# EasyEDA Pro project ProDoc_TC264主板V2.0_2025-08-21.epro, schematic Schematic1_4
Board Name: TC264主板V2.0; Create Date: 2025-06-05; Page Name: P1; Project Name: 2025双车主板_备份; Schematic Name: Schematic1_4; Update Date: 2025-08-20; Company: 嘉立创EDA; Page Size: A4; Version: V1.0
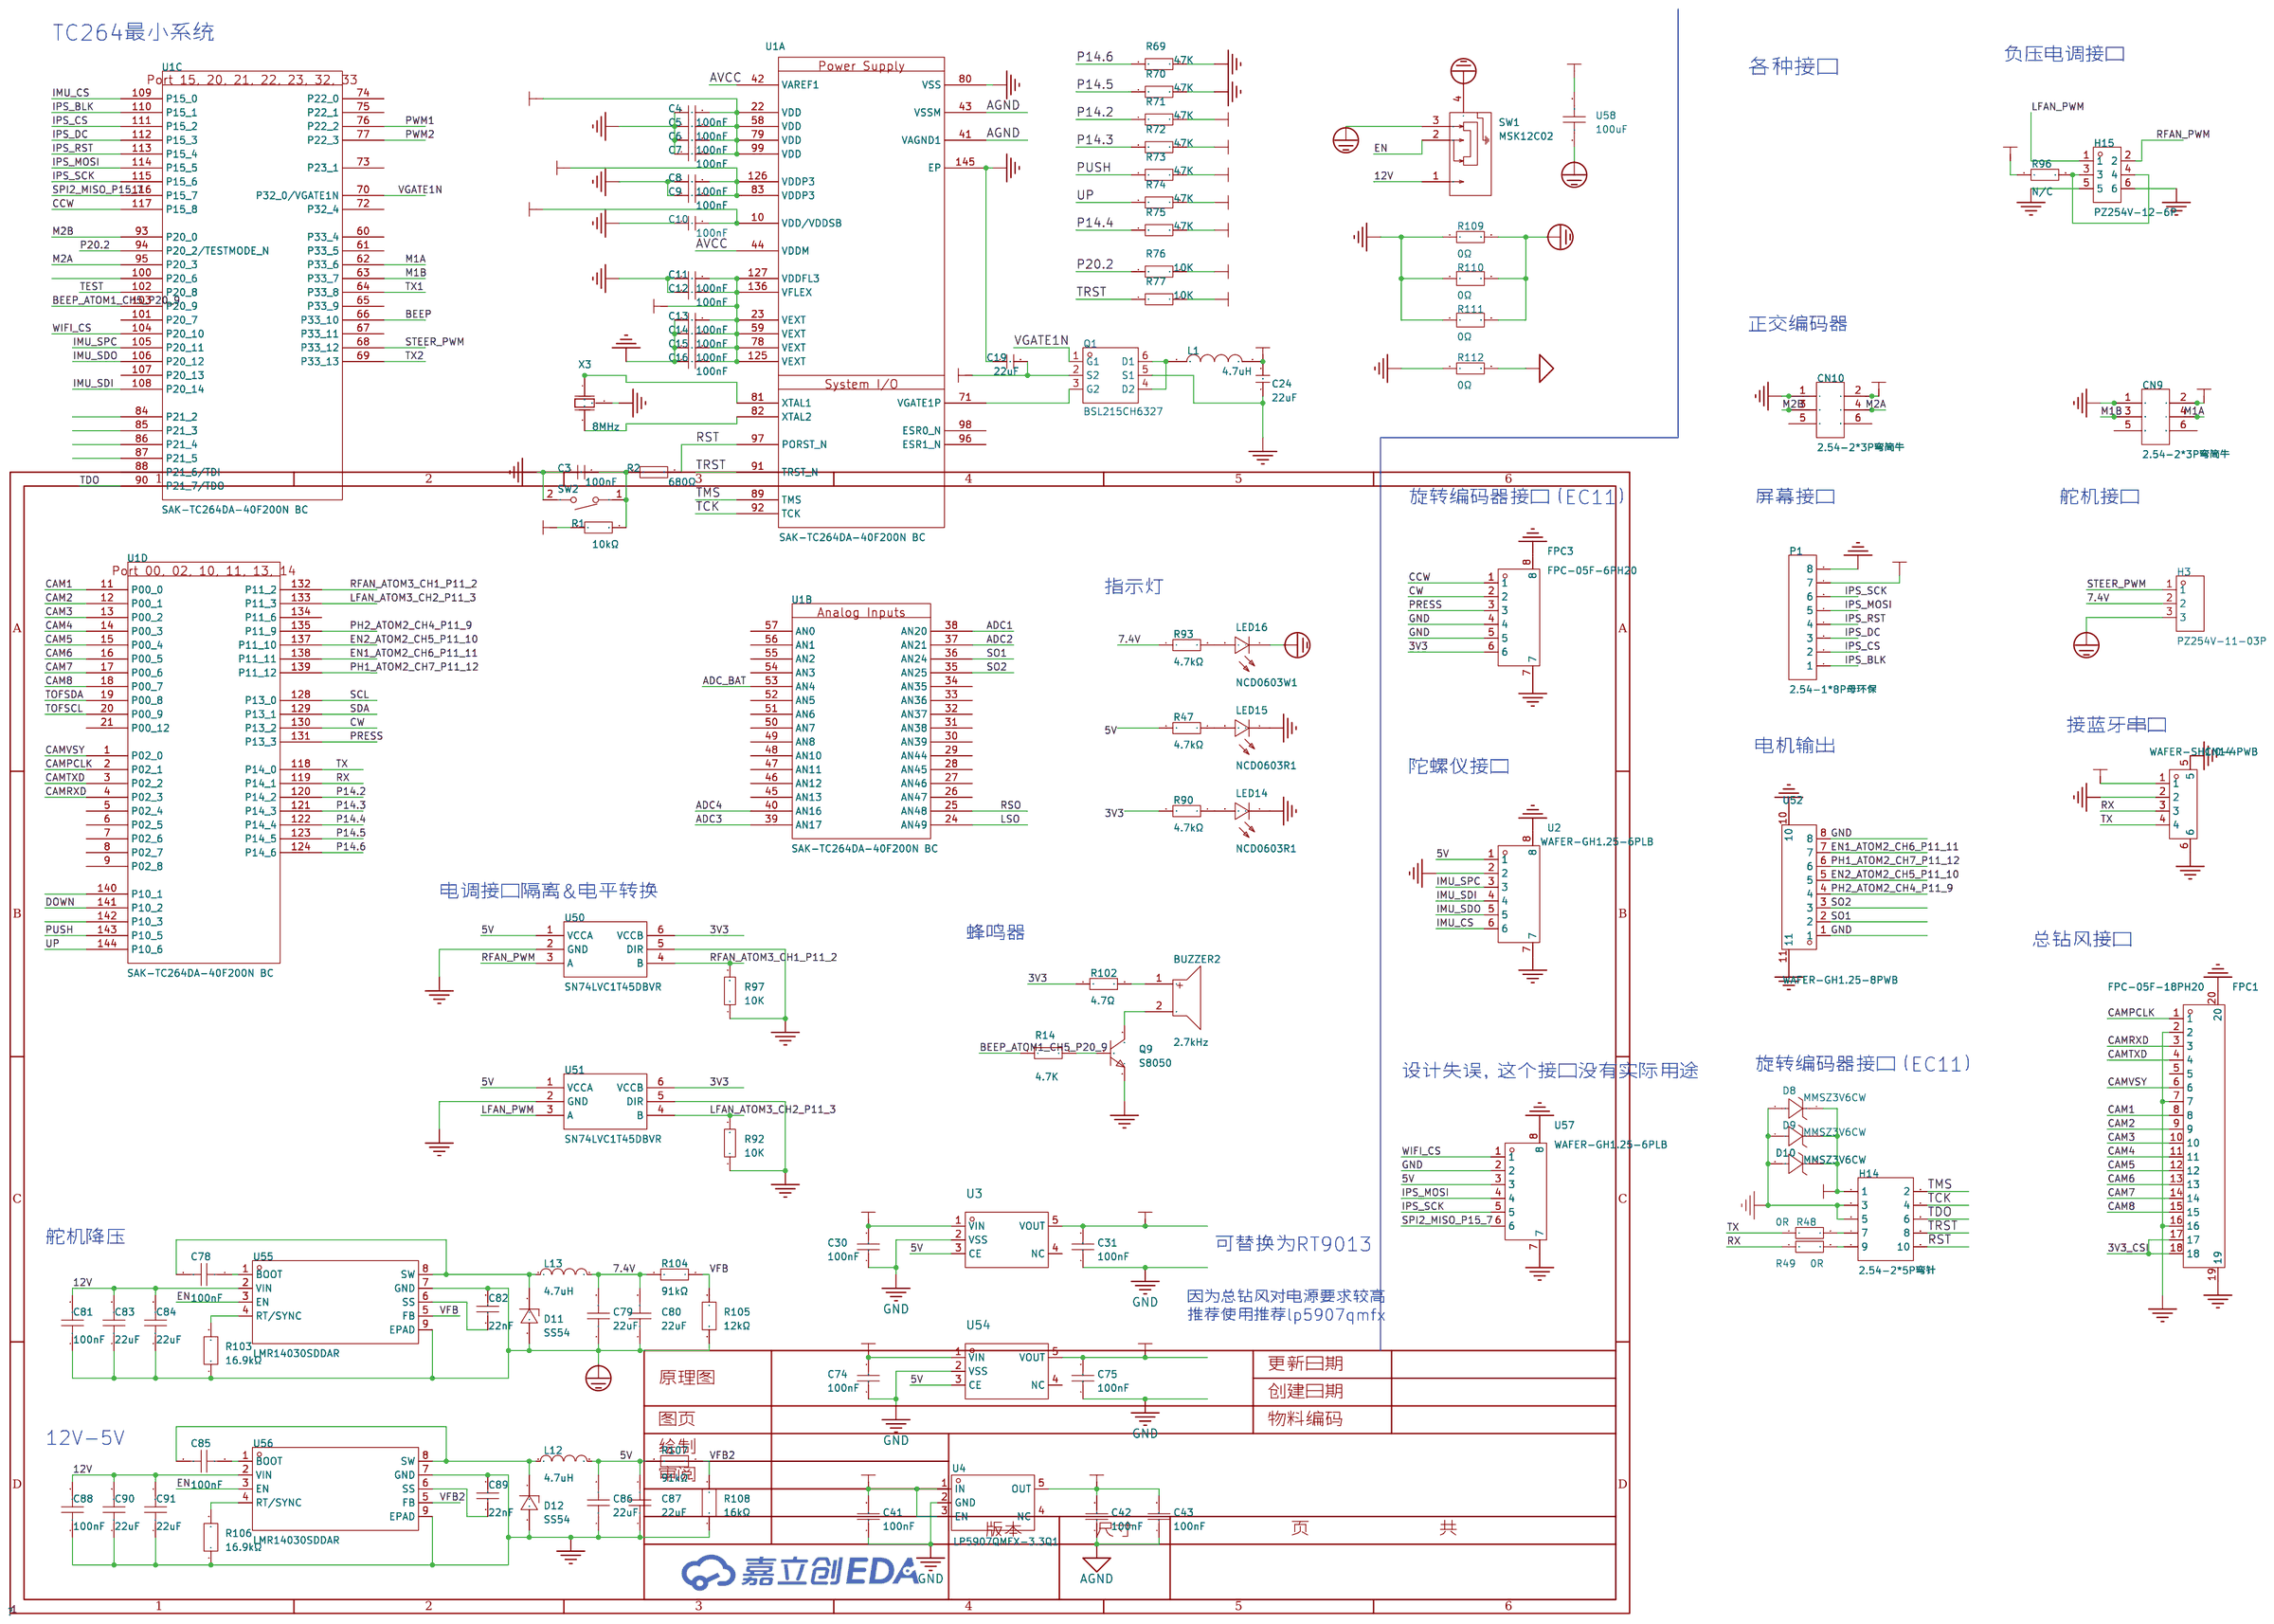
[diagram p0: schematic sheet]

## Parts
BUZZER2  2.7kHz  [BUZ-TH_BD9.0-P4.00-D0.6-FD]
C3  100nF  [C0603]
C4  100nF  [C0603]
C5  100nF  [C0603]
C6  100nF  [C0603]
C7  100nF  [C0603]
C8  100nF  [C0603]
C9  100nF  [C0603]
C10  100nF  [C0603]
C11  100nF  [C0603]
C12  100nF  [C0603]
C13  100nF  [C0603]
C14  100nF  [C0603]
C15  100nF  [C0603]
C16  100nF  [C0603]
C19  22uF  [C0805]
C24  22uF  [C0805]
C30  100nF  [C0603_S]
C31  100nF  [C0603_S]
C41  100nF  [C0603_S]
C42  100nF  [C0603_S]
C43  100nF  [C0603_S]
C74  100nF  [C0603_S]
C75  100nF  [C0603_S]
C78  100nF  [C0603]
C79  22uF  [C0805]
C80  22uF  [C0805]
C81  100nF  [C0603]
C82  22nF  [C0603]
C83  22uF  [C0805]
C84  22uF  [C0805]
C85  100nF  [C0603]
C86  22uF  [C0805]
C87  22uF  [C0805]
C88  100nF  [C0603]
C89  22nF  [C0603]
C90  22uF  [C0805]
C91  22uF  [C0805]
CN9  2.54-2*3P弯简牛  [IDC-TH_6P-P2.54-H-R2-C3-S2.54]
CN10  2.54-2*3P弯简牛  [IDC-TH_6P-P2.54-H-R2-C3-S2.54]
CN14  WAFER-SH1.0-4PWB  [CONN-SMD_4P-P1.00_WAFER-SH1.0-4PWB]
D8  MMSZ3V6CW  [SOD-123_L2.7-W1.6-LS3.7-RD-1]
D9  MMSZ3V6CW  [SOD-123_L2.7-W1.6-LS3.7-RD-1]
D10  MMSZ3V6CW  [SOD-123_L2.7-W1.6-LS3.7-RD-1]
D11  SS54  [SMA_L4.3-W2.6-LS5.0-FD]
D12  SS54  [SMA_L4.3-W2.6-LS5.0-FD]
FPC1  FPC-05F-18PH20  [FPC-SMD_18P-P0.50_FPC-05F-18PH20]
FPC3  FPC-05F-6PH20  [FPC-SMD_6P-P0.50_XUNPU_FPC-05F-6PH20]
H3  PZ254V-11-03P  [HDR-TH_3P-P2.54-V-M]
H14  2.54-2*5P弯针  [HDR-TH_10P-P2.54-H-M-R2-C5-S2.54-W12.9]
H15  PZ254V-12-6P  [HDR-TH_6P-P2.54-V-M-R2-C3-S2.54]
L1  4.7uH  [L0805]
L12  4.7uH  [IND-SMD_L7.0-W6.6]
L13  4.7uH  [IND-SMD_L7.0-W6.6]
LED14  NCD0603R1  [LED0603-RD_RED]
LED15  NCD0603R1  [LED0603-RD_RED]
LED16  NCD0603W1  [LED0603-RD]
P1  2.54-1*8P母环保  [HDR-TH_8P-P2.54-V-F-1]
Q1  BSL215CH6327  [TSOP-6_L3.0-W1.5-P0.95-LS2.8-BL]
Q9  S8050  [SOT-23-3_L2.9-W1.3-P1.90-LS2.4-BR]
R1  10kΩ  [R0603]
R2  680Ω  [R0603]
R14  4.7K  [R0603]
R47  4.7kΩ  [R0603]
R48  0R  [R0603]
R49  0R  [R0603]
R69  47K  [R0603]
R70  47K  [R0603]
R71  47K  [R0603]
R72  47K  [R0603]
R73  47K  [R0603]
R74  47K  [R0603]
R75  47K  [R0603]
R76  10K  [R0603]
R77  10K  [R0603]
R90  4.7kΩ  [R0603]
R92  10K  [R0603]
R93  4.7kΩ  [R0603]
R96  N/C  [R0603]
R97  10K  [R0603]
R102  4.7Ω  [R0603]
R103  16.9kΩ  [R0603]
R104  91kΩ  [R0603]
R105  12kΩ  [R0603]
R106  16.9kΩ  [R0603]
R107  91kΩ  [R0603]
R108  16kΩ  [R0603]
R109  0Ω  [R1206]
R110  0Ω  [R1206]
R111  0Ω  [R1206]
R112  0Ω  [R0603]
SW1  MSK12C02  [SW-TH_MSK12C02]
SW2  TS-1063S-B3D4  [KEY-SMD_L3.0-W2.5-LS4.0_TS-1603S]
U1  SAK-TC264DA-40F200N BC  [LQFP-144_L20.0-W20.0-P0.50-LS22.0-BL-EP-1]  (sections 1,2,3,4)
U2  WAFER-GH1.25-6PLB  [CONN-SMD_6P-P1.25_XUNPU_WAFER-GH1.25-6PLB]
U3  XC6210B332MR  [SOT-23-5_L3.0-W1.7-P0.95-LS2.8-BR]
U4  LP5907QMFX-3.3Q1  [SOT-23-5_L3.0-W1.7-P0.95-LS2.8-BR]
U50  SN74LVC1T45DBVR  [SOT-23-6_L2.9-W1.6-P0.95-LS2.8-BR]
U51  SN74LVC1T45DBVR  [SOT-23-6_L2.9-W1.6-P0.95-LS2.8-BR]
U52  WAFER-GH1.25-8PWB  [CONN-SMD_8P-P1.25_XUNPU-WAFER-GH1.25-8PWB]
U54  XC6210B332MR  [SOT-23-5_L3.0-W1.7-P0.95-LS2.8-BR]
U55  LMR14030SDDAR  [SO-8_L4.9-W3.9-P1.27-LS6.0-BL-EP]
U56  LMR14030SDDAR  [SO-8_L4.9-W3.9-P1.27-LS6.0-BL-EP]
U57  WAFER-GH1.25-6PLB  [CONN-SMD_6P-P1.25_XUNPU_WAFER-GH1.25-6PLB]
U58  100uF  [C1210]
X3  8MHz  [OSC-SMD_3P-L3.2-W1.3-P1.20-L]

## Library data of the parts
BUZZER2 = QMB-09B-03: 驱动方式:无源(外部驱动);构造类型:电磁式;频率:2.7kHz;声压(SPL):85dB@3V,10cm;; LCSC Part Name: 无源蜂鸣器QMB-09B-03; Supplier Part: C96256; Manufacturer: 华能; Supplier Footprint: 插件,D=9mm; JLCPCB Part Class: 扩展库; Datasheet: https://atta.szlcsc.com/upload/public/pdf/source/20210401/C96256_958B17753B5AD7CBFBCFFC7C095B4484.pdf; Supplier: LCSC; Oscillator Circuit: 无源(外部驱动); Technology Type: 电磁式; Operating Voltage: 2V~5V; Sound Pressure Level (SPL): 85dB@3V,10cm; Diameter (φD): 9mm; Height: 5.7mm
C3-C16 = 0603B104K500NT: 容值:100nF;精度:±10%;额定电压:50V;材质(温度系数):X7R;; LCSC Part Name: 100nF ±10% 50V; Supplier Part: C30926; Manufacturer: FH(风华); Supplier Footprint: 0603; JLCPCB Part Class: Extended Part; Datasheet: https://atta.szlcsc.com/upload/public/pdf/source/20170923/C30926_1506149436298988724.pdf; Supplier: LCSC; Tolerance: ±10%; Voltage Rated: 50V; Temperature Coefficient: X7R; Origin Footprint 1: C 0603_L; Design Item ID: C; Library Name: 0.1 - 电阻-电容-电感; BOM名称: 无极性贴片电容; 优秀评价可免费更新: 联系淘宝ID：黄晶宝石，获取更新版封装库; 卖家免费技术支持，联系售后: 唯一出售店铺网址https://shop463601444.taobao.com; 本封装库来自淘宝卖家 ID：黄晶宝石: 其他店铺购入均为盗版，请立即申请退款; Origin Footprint 2: C 0201_L; Origin Footprint 3: C 0402_L; Origin Footprint 4: C 0805_L; Origin Footprint 5: C 1206_L; Origin Footprint 6: C 1210_L; Origin Footprint 7: C 1808_L; Origin Footprint 8: C 1812_L; Origin Footprint 9: C 1825_L; Origin Footprint 10: C 2225_L; Origin Footprint 11: C 0201_M; Origin Footprint 12: C 0402_M; Origin Footprint 13: C 0603_M; Origin Footprint 14: C 0805_M; Origin Footprint 15: C 1206_M; Origin Footprint 16: C 1210_M; Origin Footprint 17: C 1808_M; Origin Footprint 18: C 1812_M; Origin Footprint 19: C 1825_M; Origin Footprint 20: C 2225_M
C19 C24 = CL21A226MAQNNNE_C45783: 容值:22uF;精度:±20%;额定电压:25V;材质(温度系数):X5R;; LCSC Part Name: 22uF ±20% 25V; Supplier Part: C45783; Manufacturer: SAMSUNG(三星); Manufacturer Part: CL21A226MAQNNNE; Supplier Footprint: 0805; JLCPCB Part Class: Basic Part; Datasheet: https://atta.szlcsc.com/upload/public/pdf/source/20160218/1457707763339.pdf; Supplier: LCSC; Tolerance: ±20%; Voltage Rated: 25V; Temperature Coefficient: X5R; Origin Footprint 1: C 0805_L; Design Item ID: C; Library Name: 0.1 - 电阻-电容-电感; BOM名称: 无极性贴片电容; 优秀评价可免费更新: 联系淘宝ID：黄晶宝石，获取更新版封装库; 卖家免费技术支持，联系售后: 唯一出售店铺网址https://shop463601444.taobao.com; 本封装库来自淘宝卖家 ID：黄晶宝石: 其他店铺购入均为盗版，请立即申请退款; Origin Footprint 2: C 0201_L; Origin Footprint 3: C 0402_L; Origin Footprint 4: C 0603_L; Origin Footprint 5: C 1206_L; Origin Footprint 6: C 1210_L; Origin Footprint 7: C 1808_L; Origin Footprint 8: C 1812_L; Origin Footprint 9: C 1825_L; Origin Footprint 10: C 2225_L; Origin Footprint 11: C 0201_M; Origin Footprint 12: C 0402_M; Origin Footprint 13: C 0603_M; Origin Footprint 14: C 0805_M; Origin Footprint 15: C 1206_M; Origin Footprint 16: C 1210_M; Origin Footprint 17: C 1808_M; Origin Footprint 18: C 1812_M; Origin Footprint 19: C 1825_M; Origin Footprint 20: C 2225_M
C30 C31 C41-C43 C74 C75 = 0603B104K500NT: 容值:100nF;精度:±10%;额定电压:50V;材质(温度系数):X7R;; LCSC Part Name: 100nF ±10% 50V; Supplier Part: C30926; Manufacturer: FH(风华); Supplier Footprint: 0603; JLCPCB Part Class: Extended Part; Datasheet: https://atta.szlcsc.com/upload/public/pdf/source/20170923/C30926_1506149436298988724.pdf; Supplier: LCSC; Tolerance: ±10%; Voltage Rated: 50V; Temperature Coefficient: X7R; Pin Type: IN; Check: true
C78 C81 C85 C88 = CGA0603X7R104K500JT: 容值:100nF;精度:±10%;额定电压:50V;材质(温度系数):X7R;; LCSC Part Name: 100nF ±10% 50V; Supplier Part: C6119867; Manufacturer: HRE(芯声); Supplier Footprint: 0603; JLCPCB Part Class: 扩展库; Supplier: LCSC; Tolerance: ±10%; Voltage Rated: 50V; Temperature Coefficient: X7R
C79 C80 C83 C84 C86 C87 C90 C91 = CGA0805X5R226M350MT: 容值:22uF;精度:±20%;额定电压:35V;材质(温度系数):X5R;; LCSC Part Name: 22uF ±20% 35V; Supplier Part: C6119901; Manufacturer: HRE(芯声); Supplier Footprint: 0805; JLCPCB Part Class: 扩展库; Datasheet: https://atta.szlcsc.com/upload/public/pdf/source/20231129/D589D0CC4D260F7AC3A77E53B455CCB3.pdf; Supplier: LCSC; Tolerance: ±20%; Voltage Rated: 35V; Temperature Coefficient: X5R
C82 C89 = CL10B223KB8NNNC: 容值:22nF;精度:±10%;额定电压:50V;材质(温度系数):X7R;; LCSC Part Name: 22nF ±10% 50V; Supplier Part: C21122; Manufacturer: SAMSUNG(三星); Supplier Footprint: 0603; JLCPCB Part Class: 基础库; Datasheet: https://atta.szlcsc.com/upload/public/pdf/source/20160218/1457707763339.pdf; Supplier: LCSC; Tolerance: ±10%; Voltage Rated: 50V; Temperature Coefficient: X7R
CN9 CN10 = 2.54-2*3P弯简牛: 连接器类型:简牛座;间距:2.54mm;结构:2x3P;封装形式:弯插;行距:2.54mm;排数:2;每排PIN数:3;触头材质:-;触头镀层:-;; LCSC Part Name: 2.54mm 2x3P 排数:2 每排P数:3; Supplier Part: C34945; Manufacturer: BOOMELE(博穆精密); Supplier Footprint: 弯插,P=2.54mm; JLCPCB Part Class: 扩展库; Datasheet: https://atta.szlcsc.com/upload/public/pdf/source/20151118/1457707580629.pdf; Supplier: LCSC; Connector Type: 简牛座; Pitch: 2.54mm; Structure: 2x3P; Holder Type: 弯插; Row Spacing: 2.54mm; Number of Rows: 2; Pin Number in each Row: 3
CN14 = WAFER-SH1.0-4PWB: 插针结构:1x4P;间距:1mm;安装方式:卧贴;参考系列:SH;总PIN数:4P;排数:1;每排PIN数:4;行距:-;额定电流:1A;触头材质:黄铜;触头镀层:-;工作温度:-25℃~+85℃;; LCSC Part Name: 1x4P 间距:1mm 卧贴 系列:SH; Supplier Part: C3029343; Manufacturer: XUNPU(讯普); Supplier Footprint: SMD,P=1mm,卧贴; JLCPCB Part Class: 扩展库; Datasheet: https://atta.szlcsc.com/upload/public/pdf/source/20220527/1879B8210BD3B2006BCEAC1A40D397B6.pdf; Supplier: LCSC; Pins Structure: 1x4P; Pitch: 1mm; Mounting Type: 卧贴; Reference Series: SH; Number of Pins: 4P; Number of Rows: 1; Number of PINs Per Row: 4; Current Rating: 1A; Contact Material: 黄铜; Operating Temperature: -25℃~+85℃; Voltage Rating: 50V; Plastic Material: LCP; Supplementary Features: 辅助焊脚; Color: 米色; Z-Height of the Board: 3.15mm; X-Length of Bottom Edge on Board (Spacing Line): 6.35mm; Y-Width of Bottom Edge on Board: 5.05mm
D8-D10 = MMSZ3V6CW_C2922768: 二极管配置:独立式;稳压值(标称值):3.6V;稳压值(范围):3.4V~3.8V;功率(Pd):500mW;; Supplier Part: C2922768; Manufacturer: YONGYUTAI(永裕泰); Supplier Footprint: SOD-123; JLCPCB Part Class: 扩展库; Datasheet: https://atta.szlcsc.com/upload/public/pdf/source/20211122/29A56FCE15FF4805B7432A7DEF4BEF09.pdf; Supplier: LCSC; Diode Configuration: 独立式; Zener Voltage (Nom): 3.6V; Zener Voltage (Range): 3.4V~3.8V; Power Dissipation: 500mW; Zener Impedance (Zzt): 90Ω
D11 D12 = SS54_C7420369: 二极管配置:独立式;正向压降(Vf):550mV@5.0A;直流反向耐压(Vr):40V;整流电流:5A;; LCSC Part Name: 电压:40V 电流:5A; Supplier Part: C7420369; Manufacturer: 宏迦橙; Supplier Footprint: SMA(DO-214AC); JLCPCB Part Class: 扩展库; Datasheet: https://atta.szlcsc.com/upload/public/pdf/source/20230828/254C3882F8647358AD9F60DD73611B5E.pdf; Supplier: LCSC; Diode Configuration: 独立式; Forward Voltage (Vf@If): 550mV@5.0A; Reverse Voltage (Vr): 40V; Rectified Current: 5A; Reverse Leakage Current (Ir): 50uA@40V
FPC1 = FPC-05F-18PH20: 锁定特性:翻盖式;触点类型:下接;触点数量:18P;间距:0.5mm;安装类型:卧贴;工作温度范围:-25℃~+85℃;; LCSC Part Name: 间距:0.5mm P数:18P 翻盖式 下接; Supplier Part: C2856802; Manufacturer: XUNPU(讯普); Supplier Footprint: SMD,P=0.5mm,卧贴; JLCPCB Part Class: 扩展库; Datasheet: https://atta.szlcsc.com/upload/public/pdf/source/20210922/C2856802_2A845D1961F33AEC1ED22CECB292335F.pdf; Supplier: LCSC; Locking Feature: 翻盖式; Contact Type: 下接; Number of Contacts: 18P; Pitch: 0.5mm; Mounting Type: 卧贴; FFC, FCB Thickness: 0.3mm; Height Above Board: 2mm; Operating Temperature Range: -25℃~+85℃
FPC3 = FPC-05F-6PH20: 锁定特性:翻盖式;触点类型:下接;触点数量:6P;间距:0.5mm;安装类型:卧贴;工作温度范围:-25℃~+85℃;; LCSC Part Name: 间距:0.5mm P数:6P 翻盖式 下接; Supplier Part: C2856796; Manufacturer: XUNPU(讯普); Supplier Footprint: SMD,P=0.5mm,卧贴; JLCPCB Part Class: 扩展库; Datasheet: https://atta.szlcsc.com/upload/public/pdf/source/20210922/16B003FB53336DDF6538142CC465AC4D.pdf; Supplier: LCSC; Locking Feature: 翻盖式; Contact Type: 下接; Number of Contacts: 6P; Pitch: 0.5mm; Mounting Type: 卧贴; FFC, FCB Thickness: 0.3mm; Height Above Board: 2mm; Operating Temperature Range: -25℃~+85℃
H3 = PZ254V-11-03P: 插针结构:1x3P;间距:2.54mm;行距:-;圆针/方针:方针;安装类型:直插;排数:单排;总PIN位数:3P;额定电流:3A;额定电压:250V;配合针长度:6mm;塑高:2.5mm;端接针长度:3mm;工作温度范围:-40℃~+105℃;颜色:黑色;; LCSC Part Name: 间距:2.54mm 1x3P 直插 方针; Supplier Part: C2937625; Manufacturer: XFCN(兴飞); Supplier Footprint: 插件,P=2.54mm; JLCPCB Part Class: 扩展库; Datasheet: https://atta.szlcsc.com/upload/public/pdf/source/20200309/C492402_8335C3D49C4E4C618838D59BB1D024C1.pdf; Supplier: LCSC; Pin Structure: 1x3P; Pitch: 2.54mm; Circluar Pins/Square Pins: 方针; Mounting Type: 直插; Number of Rows: 单排; Number of Pins: 3P; Current Rating (Max): 3A; Voltage Rating (Max): 250V; Length of Mating Pin: 6mm; Insulation Height: 2.5mm; Length of End Connection Pin: 3mm; Operating Temperature Range: -40℃~+105℃; Color: 黑色
H14 = 2.54-2*5P弯针: 插针结构:2x5P;间距:2.54mm;行距:2.54mm;圆针/方针:方针;安装类型:弯插;排数:双排;总PIN位数:10P;额定电流:3A;额定电压:-;配合针长度:6mm;塑高:2.54mm;触头材质:黄铜;触头镀层:-;工作温度范围:-55℃~+105℃;颜色:黑色;; LCSC Part Name: 间距:2.54mm 2x5P 弯插 方针; Supplier Part: C60563; Manufacturer: BOOMELE(博穆精密); Supplier Footprint: 弯插,P=2.54mm; JLCPCB Part Class: 扩展库; Datasheet: https://atta.szlcsc.com/upload/public/pdf/source/20201009/C60563_5FFC87C912161176506B1BF1C101B88D.pdf; Supplier: LCSC; Pin Structure: 2x5P; Pitch: 2.54mm; Row Spacing: 2.54mm; Circluar Pins/Square Pins: 方针; Mounting Type: 弯插; Number of Rows: 双排; Number of Pins: 10P; Current Rating (Max): 3A; Length of Mating Pin: 6mm; Insulation Height: 2.54mm; Contact Material: 黄铜; Operating Temperature Range: -55℃~+105℃; Color: 黑色
H15 = PZ254V-12-6P: 插针结构:2x3P;间距:2.54mm;行距:2.54mm;圆针/方针:方针;安装类型:直插;排数:双排;总PIN位数:6P;额定电流:-;额定电压:-;配合针长度:6mm;塑高:2.5mm;端接针长度:3mm;触头材质:黄铜;触头镀层:-;工作温度范围:-40℃~+105℃;颜色:黑色;; LCSC Part Name: 间距:2.54mm 2x3P 直插 方针; Supplier Part: C492420; Manufacturer: XFCN(兴飞); Supplier Footprint: 插件,P=2.54mm; JLCPCB Part Class: 扩展库; Datasheet: https://atta.szlcsc.com/upload/public/pdf/source/20200309/C492420_BAECB307B001054C09D200388220EAE6.pdf; Supplier: LCSC; Pin Structure: 2x3P; Pitch: 2.54mm; Row Spacing: 2.54mm; Circluar Pins/Square Pins: 方针; Mounting Type: 直插; Number of Rows: 双排; Number of Pins: 6P; Length of Mating Pin: 6mm; Insulation Height: 2.5mm; Length of End Connection Pin: 3mm; Contact Material: 黄铜; Operating Temperature Range: -40℃~+105℃; Color: 黑色
L1 = LQM21PL4R7MGCD: 电感值:4.7uH;精度:±20%;额定电流:500mA;饱和电流(Isat):-;直流电阻(DCR):812mΩ;; LCSC Part Name: 4.7uH ±20% 812mΩ; Supplier Part: C86088; Manufacturer: muRata(村田); Supplier Footprint: 0805; JLCPCB Part Class: Extended Part; Datasheet: https://atta.szlcsc.com/upload/public/pdf/source/20170914/C86088_1505374139550969215.pdf; Supplier: LCSC; Tolerance: ±20%; Rated Current: 500mA; DC Resistance (DCR): 812mΩ; Origin Footprint 1: L 0805; Design Item ID: L; Library Name: 0.1 - 电阻-电容-电感; BOM名称: 小功率贴片电感; 优秀评价可免费更新: 联系淘宝ID：黄晶宝石，获取更新版封装库; 卖家免费技术支持，联系售后: 唯一出售店铺网址https://shop463601444.taobao.com; 本封装库来自淘宝卖家 ID：黄晶宝石: 其他店铺购入均为盗版，请立即申请退款; Origin Footprint 2: L 0402; Origin Footprint 3: L 0603; Origin Footprint 4: L 1206; Origin Footprint 5: L 1210; Origin Footprint 6: L 1806; Origin Footprint 7: L 1812
L12 L13 = FXL0630-4R7-M: 电感值:4.7uH;精度:±20%;额定电流:6A;饱和电流(Isat):9A;类型:一体成型电感;; LCSC Part Name: 4.7uH ±20% 9A; Supplier Part: C167220; Manufacturer: cjiang(长江微电); Supplier Footprint: SMD,6.6x7mm; JLCPCB Part Class: 扩展库; Datasheet: https://atta.szlcsc.com/upload/public/pdf/source/20240426/3189EA8206330E2108542F9E34E540E7.pdf; Supplier: LCSC; Tolerance: ±20%; Rated Current: 6A; Saturation Current (Isat): 9A; DC Resistance (DCR): 33mΩ; Type: 一体成型电感
LED14 LED15 = NCD0603R1_C84263: 灯头类型:-;发光颜色:红色;正向电压(VF):1.6V~2.6V;功率:65mW;正向电流:20mA;主波长:615nm~630nm;二极管配置:独立二极管;透镜颜色:无色透明透镜;色温:-;发光强度:80mcd~220mcd;发光角度:130°;载带方式:-;工作温度:-30℃~+85℃;; Supplier Part: C84263; Manufacturer: 国星光电; Supplier Footprint: 0603; JLCPCB Part Class: 扩展库; Datasheet: https://atta.szlcsc.com/upload/public/pdf/source/20200820/C84263_DABC6A75E58F576973B407FDBA283D60.pdf; Supplier: LCSC; Emitted Color: 红色; Forward Voltage (VF): 1.6V~2.6V; Power Dissipation: 65mW; Forward Current: 20mA; Dominant Wavelength: 615nm~630nm; Diode Configuration: 独立二极管; Lens Color: 无色透明透镜; Luminous Intensity: 80mcd~220mcd; Viewing Angle: 130°; Operating Temperature: -30℃~+85℃
LED16 = NCD0603W1: 发光颜色:白色;正向电压(VF):2.6V~3.6V;功率:72mW;正向电流:5mA;透镜颜色:雾状黄透镜;发光强度:200mcd~300mcd;发光角度:130°;工作温度:-30℃~+85℃;; Supplier Part: C84265; Manufacturer: 国星光电; Supplier Footprint: 0603; JLCPCB Part Class: 扩展库; Datasheet: https://atta.szlcsc.com/upload/public/pdf/source/20200820/C84265_479E6193713348A548E5CD6D9278BF16.pdf; Supplier: LCSC; Emitted Color: 白色; Forward Voltage (VF): 2.6V~3.6V; Power Dissipation: 72mW; Forward Current: 5mA; Lens Color: 雾状黄透镜; Luminous Intensity: 200mcd~300mcd; Viewing Angle: 130°; Operating Temperature: -30℃~+85℃
P1 = 2.54-1*8P母环保: 插孔结构:1x8P;间距:2.54mm;行距:-;安装类型:直插;排数:单排;总孔位数:8P;塑高:-;触头材质:-;触头镀层:-;; LCSC Part Name: 间距:2.54mm 1x8P 直插; Supplier Part: C27438; Manufacturer: BOOMELE(博穆精密); Supplier Footprint: 插件,P=2.54mm; JLCPCB Part Class: 扩展库; Datasheet: https://atta.szlcsc.com/upload/public/pdf/source/20231221/1CA800C6799ED97958773716FAA1BFFE.pdf; Supplier: LCSC; Holes Structure: 1x8P; Pitch: 2.54mm; Mounting Type: 直插; Number of Rows: 单排; Number of Holes: 8P
Q1 = BSL215CH6327: 类型:1个N沟道和1个P沟道;漏源电压(Vdss):20V;连续漏极电流(Id):1.5A;功率(Pd):500mW;导通电阻(RDS(on)@Vgs,Id):140mΩ@4.5V,1.5A;阈值电压(Vgs(th)@Id):1.2V@3.7uA;; LCSC Part Name: 1个N沟道和1个P沟道 20V 1.5A; Supplier Part: C150914; Manufacturer: Infineon(英飞凌); Supplier Footprint: TSOP-6-1.5mm; JLCPCB Part Class: Extended Part; Datasheet: https://atta.szlcsc.com/upload/public/pdf/source/20180125/C150914_15168616334001301814.pdf; Supplier: LCSC; Type: 1个N沟道和1个P沟道; Drain Source Voltage (Vdss): 20V; Continuous Drain Current (Id): 1.5A; Power Dissipation (Pd): 500mW; Drain Source On Resistance (RDS(on)@Vgs,Id): 140mΩ@4.5V,1.5A; Gate Threshold Voltage (Vgs(th)@Id): 1.2V@3.7uA; Design Item ID: BSL215CH6327XTSA1; Library Name: TC264飞卡板
Q9 = S8050_C2891804: 晶体管类型:NPN;集电极电流(Ic):500mA;集射极击穿电压(Vceo):25V;功率(Pd):300mW;; LCSC Part Name: NPN 电流:500mA 耐压:25V; Supplier Part: C2891804; Manufacturer: YONGYUTAI(永裕泰); Supplier Footprint: SOT-23; JLCPCB Part Class: 扩展库; Datasheet: https://atta.szlcsc.com/upload/public/pdf/source/20210901/5347316A10609C628D4D69AE01446E5B.pdf; Supplier: LCSC; Transistor Type: NPN; Collector Current (Ic): 500mA; Collector-Emitter Breakdown Voltage (Vceo): 25V; Power Dissipation (Pd): 300mW; Collector Cut-Off Current (Icbo): 1uA; Collector-Emitter Saturation Voltage (VCE(sat)@Ic,Ib): 500mV@500mA,50mA
R1 = 0603WAF1002T5E: 电阻类型:厚膜电阻;阻值:10kΩ;精度:±1%;功率:100mW;最大工作电压:75V;温度系数:±100ppm/℃;; LCSC Part Name: 厚膜电阻 10kΩ ±1% 100mW; Supplier Part: C25804; Manufacturer: UNI-ROYAL(厚声); Supplier Footprint: 0603; JLCPCB Part Class: 基础库; Datasheet: https://atta.szlcsc.com/upload/public/pdf/source/20200306/C422600_1E6D84923E4A46A82E41ADD87F860B5C.pdf; Supplier: LCSC; Type: 厚膜电阻; Tolerance: ±1%; Power(Watts): 100mW; Overload Voltage (Max): 75V; Temperature Coefficient: ±100ppm/℃; Operating Temperature Range: -55℃~+155℃; Origin Footprint 1: R 0603_L; Design Item ID: R; Library Name: 0.1 - 电阻-电容-电感; BOM名称: 贴片电阻; 优秀评价可免费更新: 联系淘宝ID：黄晶宝石，获取更新版封装库; 卖家免费技术支持，联系售后: 唯一出售店铺网址https://shop463601444.taobao.com; 本封装库来自淘宝卖家 ID：黄晶宝石: 其他店铺购入均为盗版，请立即申请退款; Origin Footprint 2: R 0201_L; Origin Footprint 3: R 0402_L; Origin Footprint 4: R 0805_L; Origin Footprint 5: R 1206_L; Origin Footprint 6: R 1210_L; Origin Footprint 7: R 1812_L; Origin Footprint 8: R 2010_L; Origin Footprint 9: R 2512_L; Origin Footprint 10: R 0201_M; Origin Footprint 11: R 0402_M; Origin Footprint 12: R 0603_M; Origin Footprint 13: R 0805_M; Origin Footprint 14: R 1206_M; Origin Footprint 15: R 1210_M; Origin Footprint 16: R 1812_M; Origin Footprint 17: R 2010_M; Origin Footprint 18: R 2512_M
R2 = 0603WAF6800T5E: 电阻类型:厚膜电阻;阻值:680Ω;精度:±1%;功率:100mW;温度系数:±100ppm/℃;; LCSC Part Name: 厚膜电阻 680Ω ±1% 100mW; Supplier Part: C23228; Manufacturer: UNI-ROYAL(厚声); Supplier Footprint: 0603; JLCPCB Part Class: Basic Part; Datasheet: https://atta.szlcsc.com/upload/public/pdf/source/20200306/C422600_1E6D84923E4A46A82E41ADD87F860B5C.pdf; Supplier: LCSC; Type: 厚膜电阻; Tolerance: ±1%; Power(Watts): 100mW; Temperature Coefficient: ±100ppm/℃; Overload Voltage (Max): 75V; Operating Temperature Range: -55℃~+155℃; Origin Footprint 1: R 0603_L; Design Item ID: R; Library Name: 0.1 - 电阻-电容-电感; BOM名称: 贴片电阻; 优秀评价可免费更新: 联系淘宝ID：黄晶宝石，获取更新版封装库; 卖家免费技术支持，联系售后: 唯一出售店铺网址https://shop463601444.taobao.com; 本封装库来自淘宝卖家 ID：黄晶宝石: 其他店铺购入均为盗版，请立即申请退款; Origin Footprint 2: R 0201_L; Origin Footprint 3: R 0402_L; Origin Footprint 4: R 0805_L; Origin Footprint 5: R 1206_L; Origin Footprint 6: R 1210_L; Origin Footprint 7: R 1812_L; Origin Footprint 8: R 2010_L; Origin Footprint 9: R 2512_L; Origin Footprint 10: R 0201_M; Origin Footprint 11: R 0402_M; Origin Footprint 12: R 0603_M; Origin Footprint 13: R 0805_M; Origin Footprint 14: R 1206_M; Origin Footprint 15: R 1210_M; Origin Footprint 16: R 1812_M; Origin Footprint 17: R 2010_M; Origin Footprint 18: R 2512_M
R14 R48 R49 R69-R77 R92 R97 = Res_0603: Supplier Footprint: 0603
R47 R90 = RC0603FR-074K7L: 电阻类型:厚膜电阻;阻值:4.7kΩ;精度:±1%;功率:100mW;最大工作电压:75V;温度系数:±100ppm/℃;; LCSC Part Name: 厚膜电阻 4.7kΩ ±1% 100mW; Supplier Part: C99782; Manufacturer: YAGEO(国巨); Supplier Footprint: 0603; JLCPCB Part Class: 扩展库; Datasheet: https://atta.szlcsc.com/upload/public/pdf/source/20180224/C181757_15194369480721363983.pdf; Supplier: LCSC; Type: 厚膜电阻; Tolerance: ±1%; Power(Watts): 100mW; Overload Voltage (Max): 75V; Temperature Coefficient: ±100ppm/℃; Operating Temperature Range: -55℃~+155℃
R93 = 0603WAF6801T5E: 电阻类型:厚膜电阻;阻值:6.8kΩ;精度:±1%;功率:100mW;最大工作电压:75V;温度系数:±100ppm/℃;; LCSC Part Name: 6.8kΩ ±1% 100mW 厚膜电阻; Supplier Part: C23212; Manufacturer: UNI-ROYAL(厚声); Supplier Footprint: 0603; JLCPCB Part Class: 基础库; Datasheet: https://atta.szlcsc.com/upload/public/pdf/source/20200306/C422600_1E6D84923E4A46A82E41ADD87F860B5C.pdf; Supplier: LCSC; Type: 厚膜电阻; Tolerance: ±1%; Power(Watts): 100mW; Overload Voltage (Max): 75V; Temperature Coefficient: ±100ppm/℃; Operating Temperature Range: -55℃~+155℃
R96 R112 = 0603WAF0000T5E: 电阻类型:厚膜电阻;阻值:0Ω;精度:±1%;功率:100mW;最大工作电压:75V;; LCSC Part Name: 0Ω ±1% 100mW 厚膜电阻; Supplier Part: C21189; Manufacturer: UNI-ROYAL(厚声); Supplier Footprint: 0603; JLCPCB Part Class: 基础库; Datasheet: https://atta.szlcsc.com/upload/public/pdf/source/20200306/C422600_1E6D84923E4A46A82E41ADD87F860B5C.pdf; Supplier: LCSC; Type: 厚膜电阻; Tolerance: ±1%; Power(Watts): 100mW; Overload Voltage (Max): 75V; Operating Temperature Range: -55℃~+155℃
R102 = 0603WAF1000T5E: 电阻类型:厚膜电阻;阻值:100Ω;精度:±1%;功率:100mW;最大工作电压:75V;温度系数:±200ppm/℃;; LCSC Part Name: 100Ω ±1% 100mW 厚膜电阻; Supplier Part: C22775; Manufacturer: UNI-ROYAL(厚声); Supplier Footprint: 0603; JLCPCB Part Class: 基础库; Datasheet: https://atta.szlcsc.com/upload/public/pdf/source/20200306/C422600_1E6D84923E4A46A82E41ADD87F860B5C.pdf; Supplier: LCSC; Type: 厚膜电阻; Tolerance: ±1%; Power(Watts): 100mW; Overload Voltage (Max): 75V; Temperature Coefficient: ±200ppm/℃; Operating Temperature Range: -55℃~+155℃
R103 R106 = RT0603BRD0716K9L: 电阻类型:薄膜电阻;阻值:16.9kΩ;精度:±0.1%;功率:100mW;温度系数:±25ppm/℃;; LCSC Part Name: 薄膜电阻 16.9kΩ ±0.1% 100mW; Supplier Part: C861156; Manufacturer: YAGEO(国巨); Supplier Footprint: 0603; JLCPCB Part Class: 扩展库; Datasheet: https://atta.szlcsc.com/upload/public/pdf/source/20200610/C326738_5639A9F1B6EB6E4AE2197577D3456E7F.pdf; Supplier: LCSC; Type: 薄膜电阻; Tolerance: ±0.1%; Power(Watts): 100mW; Temperature Coefficient: ±25ppm/℃; Operating Temperature Range: -55℃~+155℃
R104 R107 = 0603WAF1003T5E: 电阻类型:厚膜电阻;阻值:100kΩ;精度:±1%;功率:100mW;最大工作电压:75V;温度系数:±100ppm/℃;; LCSC Part Name: 100kΩ ±1% 100mW 厚膜电阻; Supplier Part: C25803; Manufacturer: UNI-ROYAL(厚声); Supplier Footprint: 0603; JLCPCB Part Class: 基础库; Datasheet: https://atta.szlcsc.com/upload/public/pdf/source/20200306/C422600_1E6D84923E4A46A82E41ADD87F860B5C.pdf; Supplier: LCSC; Type: 厚膜电阻; Tolerance: ±1%; Power(Watts): 100mW; Overload Voltage (Max): 75V; Temperature Coefficient: ±100ppm/℃; Operating Temperature Range: -55℃~+155℃
R105 R108 = RT0603BRD0717K8L: 电阻类型:薄膜电阻;阻值:17.8kΩ;精度:±0.1%;功率:100mW;最大工作电压:75V;温度系数:±25ppm/℃;; LCSC Part Name: 薄膜电阻 17.8kΩ ±0.1% 100mW; Supplier Part: C705729; Manufacturer: YAGEO(国巨); Supplier Footprint: 0603; JLCPCB Part Class: 扩展库; Datasheet: https://atta.szlcsc.com/upload/public/pdf/source/20200720/C705729_1DBC5D39E765E899BE7E52115517D2FD.pdf; Supplier: LCSC; Type: 薄膜电阻; Tolerance: ±0.1%; Power(Watts): 100mW; Overload Voltage (Max): 75V; Temperature Coefficient: ±25ppm/℃; Operating Temperature Range: -55℃~+155℃
R109 = 1206W4F0000T5E: 电阻类型:厚膜电阻;阻值:0Ω;精度:±1%;功率:250mW;最大工作电压:200V;温度系数:±800ppm/℃;; LCSC Part Name: 0Ω ±1% 250mW 厚膜电阻; Supplier Part: C17888; Manufacturer: UNI-ROYAL(厚声); Supplier Footprint: 1206; JLCPCB Part Class: 基础库; Datasheet: https://atta.szlcsc.com/upload/public/pdf/source/20200306/C422600_1E6D84923E4A46A82E41ADD87F860B5C.pdf; Supplier: LCSC; Type: 厚膜电阻; Tolerance: ±1%; Power(Watts): 250mW; Overload Voltage (Max): 200V; Temperature Coefficient: ±800ppm/℃; Operating Temperature Range: -55℃~+155℃
R110 R111 = FRC1206P000 TS: 电阻类型:厚膜电阻;阻值:0Ω;精度:±5%;功率:250mW;最大工作电压:200V;; LCSC Part Name: 0Ω ±5% 250mW 厚膜电阻; Supplier Part: C2907406; Manufacturer: FOJAN(富捷); Supplier Footprint: 1206; JLCPCB Part Class: 扩展库; Datasheet: https://atta.szlcsc.com/upload/public/pdf/source/20211221/925EC7D7225764EE0046F22065062C87.pdf; Supplier: LCSC; Type: 厚膜电阻; Tolerance: ±5%; Power(Watts): 250mW; Overload Voltage (Max): 200V; Operating Temperature Range: -55℃~+155℃
SW1 = MSK12C02: 电路结构:单刀双掷;安装方式:卧贴;开关颜色:-;额定电流(DC):50mA;额定电压(DC):12V;额定电流(AC):-;额定电压(AC):-;机械寿命:1万次;; LCSC Part Name: 两档侧拨贴片 7脚 滑动开关; Supplier Part: C431540; Manufacturer: SHOU HAN(首韩); Supplier Footprint: SMD; JLCPCB Part Class: 扩展库; Datasheet: https://atta.szlcsc.com/upload/public/pdf/source/20190925/C431540_89155AEF0758B9AD1B2D805F83FB12E3.pdf; Supplier: LCSC; Circuit: 单刀双掷; Pin Style: SMD接片; Switch Length: 8mm; Switch Width: 2.8mm; Switch Height: 1.4mm; Mounting Style: 卧贴; Current Rating (DC): 50mA; Voltage Rating (DC): 12V; Mechanical Life: 1万次; Operating Temperature: -20℃~+70℃
SW2 = TS-1063S-B3D4: 电路结构:单刀单掷;安装方式:-;按钮形状:方形按钮;带灯:-;作用力:250gf@±30gf;; LCSC Part Name: 轻触开关3.0*2.5侧按贴片带柱小小龟250gf; Supplier Part: C498291; Manufacturer: Yuandi(元迪); JLCPCB Part Class: 扩展库; Datasheet: https://atta.szlcsc.com/upload/public/pdf/source/20200318/C498291_A3607BD92317BA61A63F6AFAF35A0DD0.pdf; Supplier: LCSC; Circuit: 单刀单掷; Actuator Style: 方形按钮; Operating Force: 250gf@±30gf
U1 = SAK-TC264DA-40F200N BC: 32-Bit Single-Chip Microcontroller BC-Step; Supplier Part: C538796; Manufacturer: Infineon(英飞凌); Supplier Footprint: LQFP-144(20x20); JLCPCB Part Class: Extended Part; Supplier: LCSC; Library Name: TC264飞卡板; PackageReference: PG-LQFP-144-22
U2 U57 = WAFER-GH1.25-6PLB: 插针结构:1x6P;间距:1.25mm;安装方式:立贴;参考系列:GH;总PIN数:6P;排数:1;每排PIN数:6;行距:-;额定电流:1A;触头材质:黄铜;触头镀层:-;工作温度范围:-25℃~+85℃;; LCSC Part Name: 1x6P 间距:1.25mm 立贴 系列:GH; Supplier Part: C3029372; Manufacturer: XUNPU(讯普); Supplier Footprint: SMD,P=1.25mm; JLCPCB Part Class: 扩展库; Datasheet: https://atta.szlcsc.com/upload/public/pdf/source/20220527/44F824AAC8C2B617205E15955FF9C23D.pdf; Supplier: LCSC; Pins Structure: 1x6P; Pitch: 1.25mm; Mounting Type: 立贴; Reference Series: GH; Number of Pins: 6P; Number of Rows: 1; Number of PINs Per Row: 6; Current Rating: 1A; Contact Material: 黄铜; Operating Temperature: -25℃~+85℃; Voltage Rating: 125V; Plastic Material: LCP; Supplementary Features: 辅助焊脚; Color: 米色; Z-Height of the Board: 4.2mm; X-Length of Bottom Edge on Board (Spacing Line): 10.75mm; Y-Width of Bottom Edge on Board: 4.95mm
U3 U54 = XC6210B332MR_C424705: 输出类型:固定;输出极性:正;最大输入电压:6V;输出电压:3.3V;输出电流:900mA;电源纹波抑制比(PSRR):60dB@(1kHz);; Supplier Part: C424705; Manufacturer: TOREX(特瑞仕); Supplier Footprint: SOT-25; JLCPCB Part Class: Extended Part; Datasheet: https://atta.szlcsc.com/upload/public/pdf/source/20190903/C424705_1DFB2113A9A78D399905DBF688657204.pdf; Supplier: LCSC; Output Type: 固定; Output Polarity: 正; Number of Outputs: 1; Maximum Input Voltage: 6V; Output Voltage: 3.3V; Dropout Voltage: 75mV@(100mA); Output Current: 900mA; Power Supply Rejection Ratio (PSRR): 60dB@(1kHz); Power Supply Rejection Ratio (PRSS): 90dB@(100Hz),60dB@(100kHz); Check: true
U4 = LP5907QMFX-3.3Q1: 输出类型:固定;输出极性:正;最大输入电压:5.5V;输出电压:3.3V;输出电流:250mA;电源纹波抑制比(PSRR):90dB;; Supplier Part: C130005; Manufacturer: TI(德州仪器); Supplier Footprint: SOT-23-5; JLCPCB Part Class: Extended Part; Datasheet: https://atta.szlcsc.com/upload/public/pdf/source/20170918/C130005_1505703244961975089.pdf; Supplier: LCSC; Output Type: 固定; Output Polarity: 正; Number of Outputs: 1; Maximum Input Voltage: 5.5V; Output Voltage: 3.3V; Dropout Voltage: 250mV@(250mA); Output Current: 250mA; Power Supply Rejection Ratio (PSRR): 90dB; Power Supply Rejection Ratio (PRSS): 90dB@(100Hz),60dB@(100kHz); Check: true
U50 U51 = SN74LVC1T45DBVR: 数据速率:420Mbps;电压(VCCA):1.65V~5.5V;电压(VCCB):1.65V~5.5V;电路数:1;每个电路通道数:1;; Supplier Part: C7843; Manufacturer: TI(德州仪器); Supplier Footprint: SOT-23-6; JLCPCB Part Class: 扩展库; Datasheet: https://www.ti.com/cn/lit/gpn/sn74lvc1t45; Supplier: LCSC; Channel Type: 双向; Data Rate: 420Mbps; Supply Voltage (VCCA): 1.65V~5.5V; Supply Voltage (VCCB): 1.65V~5.5V; Number of Circuits: 1; Channels per Circuit: 1; Output Type: 非反相；三态; Operating Temperature: -40℃~+85℃
U52 = WAFER-GH1.25-8PWB: 插针结构:1x8P;间距:1.25mm;安装方式:卧贴;参考系列:GH;总PIN数:8P;排数:1;每排PIN数:8;额定电流:1A;工作温度范围:-25℃~+85℃;; LCSC Part Name: 1x8P 间距:1.25mm 卧贴 系列:GH; Supplier Part: C3029383; Manufacturer: XUNPU(讯普); Supplier Footprint: SMD,P=1.25mm,卧贴; JLCPCB Part Class: 扩展库; Datasheet: https://atta.szlcsc.com/upload/public/pdf/source/20220527/CB8773BFB0913C3B8ABD62CB38BA101A.pdf; Supplier: LCSC; Pins Structure: 1x8P; Pitch: 1.25mm; Mounting Style: 卧贴; Reference Series: GH; Number of Pins: 8P; Number of Rows: 1; Number of PINs Per Row: 8; Current Rating (Max): 1A; Operating Temperature Range: -25℃~+85℃
U55 U56 = LMR14030SDDAR: 功能类型:降压型;输出类型:可调;输入电压:4V~40V;输出电压:800mV~28V;输出电流(最大值):3.5A;; Supplier Part: C182078; Manufacturer: TI(德州仪器); Supplier Footprint: SO-8-EP; JLCPCB Part Class: 扩展库; Datasheet: https://www.ti.com/cn/lit/gpn/lmr14030; Supplier: LCSC; Function: 降压型; Output Type: 可调; Input Voltage: 4V~40V; Output Voltage: 800mV~28V; Output Current (Max): 3.5A; Switching Frequency: 2.5MHz; Operating Temperature: -40℃~+125℃@(TJ); Synchronous Rectification: 否; Number of Outputs: 1; Topology: 降压式; Switch tube (built-in/external): 内置
U58 = HGC1210R5107M160NSVK: 容值:100uF;精度:±20%;额定电压:16V;材质(温度系数):X5R;; LCSC Part Name: 100uF ±20% 16V; Supplier Part: C7432790; Manufacturer: Chinocera(华瓷); Supplier Footprint: 1210; JLCPCB Part Class: 扩展库; Datasheet: https://atta.szlcsc.com/upload/public/pdf/source/20240320/FAC3FEC40A78BC5CCCE96C232A94D860.pdf; Supplier: LCSC; Tolerance: ±20%; Voltage Rated: 16V; Temperature Coefficient: X5R
X3 = CSTNE8M00GH5C000R0: 频率:8MHz;内置负载电容:33pF;谐振阻抗:40Ω;; LCSC Part Name: 8MHz ±0.07% 内置负载电容:33pF; Supplier Part: C341525; Manufacturer: muRata(村田); Supplier Footprint: SMD3213-3P; JLCPCB Part Class: 扩展库; Datasheet: https://atta.szlcsc.com/upload/public/pdf/source/20181211/C341525_832BA077079E4863A5153C1DB98581D5.pdf; Supplier: LCSC; Built-in Load Capacitance: 33pF; Resonant Impedance: 40Ω; Operating Temperature: -40℃~+125℃

## Nets
1V3: C4.2 C5.2 C6.2 C7.2 C10.2 C24.2 L1.2 U1.10(VDD/VDDSB) U1.22(VDD) U1.58(VDD) U1.79(VDD) U1.99(VDD)
3V3: C8.2 C9.2 C11.2 C12.2 C13.2 C14.2 C15.2 C16.2 C19.2 C31.2 CN9.2 CN10.2 D8.1(K) D9.1(K) D10.1(K) FPC3.6 H14.1 P1.7 Q1.2(S2) R1.1 R71.2 R72.2 R73.2 R74.2 R75.2 R76.2 R77.2 R90.2 R102.1 U1.23(VEXT) U1.59(VEXT) U1.78(VEXT) U1.83(VDDP3) U1.125(VEXT) U1.126(VDDP3) U1.127(VDDFL3) U1.136(VFLEX) U3.5(VOUT) U50.6(VCCB) U51.6(VCCB)
3V3_CSI: C75.2 FPC1.17 FPC1.18 U54.5(VOUT)
5V: C30.2 C41.2 C74.2 C86.2 C87.2 CN14.1 L12.2 R47.2 R96.1 R107.2 U2.1 U3.1(VIN) U3.3(CE) U4.1(IN) U4.3(EN) U50.1(VCCA) U51.1(VCCA) U54.1(VIN) U54.3(CE) U57.3
7.4V: C79.2 C80.2 H3.2 L13.2 R93.1 R104.2
12V: C81.2 C83.2 C84.2 C88.2 C90.2 C91.2 SW1.1 U55.2(VIN) U56.2(VIN) U58.2
AGND: C42.1 C43.1 R112.2 U1.41(VAGND1) U1.43(VSSM)
AVCC: C42.2 C43.2 U1.42(VAREF1) U1.44(VDDM) U4.5(OUT)
GND: C3.1 C4.1 C5.1 C6.1 C7.1 C8.1 C9.1 C10.1 C11.1 C12.1 C13.1 C14.1 C15.1 C16.1 C19.1 C24.1 C30.1 C31.1 C41.1 C74.1 C75.1 C86.1 C87.1 C88.1 C89.2 C90.1 C91.1 CN9.1 CN10.1 CN14.2 CN14.5 CN14.6 D8.2(A) D9.2(A) D10.2(A) D12.1(A) FPC1.2 FPC1.7 FPC1.16 FPC1.19 FPC1.20 FPC3.4 FPC3.5 FPC3.7 FPC3.8 H14.3 H14.5 H15.5 H15.6 LED14.1(K) LED15.1(K) P1.8 Q1.5(S1) Q9.2(E) R69.2 R70.2 R92.1 R97.1 R106.1 R108.1 R109.1 R110.1 R111.1 R112.1 SW2.2 U1.80(VSS) U1.145(EP) U2.2 U2.7 U2.8 U3.2(VSS) U4.2(GND) U50.2(GND) U50.5(DIR) U51.2(GND) U51.5(DIR) U52.1 U52.8 U52.10 U52.11 U54.2(VSS) U56.7(GND) U56.9(EPAD) U57.2 U57.7 U57.8 X3.2(GND)
PGND: C79.1 C80.1 C81.1 C82.2 C83.1 C84.1 D11.1(A) H3.3 LED16.1(-) R103.1 R105.1 R109.2 R110.2 R111.2 SW1.3 SW1.4 U55.7(GND) U55.9(EPAD) U58.1
ADC1: U1.38(AN20)
ADC2: U1.37(AN21)
ADC3: U1.39(AN17)
ADC4: U1.40(AN16)
ADC_BAT: U1.53(AN4)
BEEP: U1.66(P33_10)
BEEP_ATOM1_CH5_P20_9: R14.1 U1.103(P20_9)
CAM1: FPC1.8 U1.11(P00_0)
CAM2: FPC1.9 U1.12(P00_1)
CAM3: FPC1.10 U1.13(P00_2)
CAM4: FPC1.11 U1.14(P00_3)
CAM5: FPC1.12 U1.15(P00_4)
CAM6: FPC1.13 U1.16(P00_5)
CAM7: FPC1.14 U1.17(P00_6)
CAM8: FPC1.15 U1.18(P00_7)
CAMPCLK: FPC1.1 U1.2(P02_1)
CAMRXD: FPC1.3 U1.4(P02_3)
CAMTXD: FPC1.4 U1.3(P02_2)
CAMVSY: FPC1.6 U1.1(P02_0)
CCW: FPC3.1 U1.117(P15_8)
CW: FPC3.2 U1.130(P13_2)
DOWN: U1.141(P10_2)
EN: SW1.2 U55.3(EN) U56.3(EN)
EN1_ATOM2_CH6_P11_11: U1.138(P11_11) U52.7
EN2_ATOM2_CH5_P11_10: U1.137(P11_10) U52.5
IMU_CS: U1.109(P15_0) U2.6
IMU_SDI: U1.108(P20_14) U2.4
IMU_SDO: U1.106(P20_12) U2.5
IMU_SPC: U1.105(P20_11) U2.3
IPS_BLK: P1.1 U1.110(P15_1)
IPS_CS: P1.2 U1.111(P15_2)
IPS_DC: P1.3 U1.112(P15_3)
IPS_MOSI: P1.5 U1.114(P15_5) U57.4
IPS_RST: P1.4 U1.113(P15_4)
IPS_SCK: P1.6 U1.115(P15_6) U57.5
LFAN_ATOM3_CH2_P11_3: R92.2 U1.133(P11_3) U51.4(B)
LFAN_PWM: H15.1 U51.3(A)
LSO: U1.24(AN49)
M1A: CN9.4 U1.62(P33_6)
M1B: CN9.3 U1.63(P33_7)
M2A: CN10.4 U1.95(P20_3)
M2B: CN10.3 U1.93(P20_0)
P14.2: R71.1 U1.120(P14_2)
P14.3: R72.1 U1.121(P14_3)
P14.4: R75.1 U1.122(P14_4)
P14.5: R70.1 U1.123(P14_5)
P14.6: R69.1 U1.124(P14_6)
P20.2: R76.1 U1.94(P20_2/TESTMODE_N)
PH1_ATOM2_CH7_P11_12: U1.139(P11_12) U52.6
PH2_ATOM2_CH4_P11_9: U1.135(P11_9) U52.4
PRESS: FPC3.3 U1.131(P13_3)
PUSH: R73.1 U1.143(P10_5)
PWM1: U1.76(P22_2)
PWM2: U1.77(P22_3)
RFAN_ATOM3_CH1_P11_2: R97.2 U1.132(P11_2) U50.4(B)
RFAN_PWM: H15.2 U50.3(A)
RSO: U1.25(AN48)
RST: H14.10 R2.2 U1.97(PORST_N)
RX: CN14.3 R49.1 U1.119(P14_1)
SCL: U1.128(P13_0)
SDA: U1.129(P13_1)
SO1: U1.36(AN24) U52.2
SO2: U1.35(AN25) U52.3
SPI2_MISO_P15_7: U1.116(P15_7) U57.6
STEER_PWM: H3.1 U1.68(P33_12)
TCK: H14.4 U1.92(TCK)
TDO: H14.6 U1.90(P21_7/TDO)
TEST: U1.102(P20_8)
TMS: H14.2 U1.89(TMS)
TOFSCL: U1.20(P00_9)
TOFSDA: U1.19(P00_8)
TRST: H14.8 R77.1 U1.91(TRST_N)
TX: CN14.4 R48.1 U1.118(P14_0)
TX1: U1.64(P33_8)
TX2: U1.69(P33_13)
UP: R74.1 U1.144(P10_6)
VFB: R104.1 R105.2 U55.5(FB)
VFB2: R107.1 R108.2 U56.5(FB)
VGATE1N: Q1.1(G1) U1.70(P32_0/VGATE1N)
WIFI_CS: U1.104(P20_10) U57.1
$1N6405: U1.82(XTAL2) X3.3(OSC2)
$1N6406: U1.81(XTAL1) X3.1(OSC1)
$1N6408: C3.2 R1.2 R2.1 SW2.1
$1N6427: Q1.3(G2) U1.71(VGATE1P)
$1N6436: L1.1 Q1.4(D2) Q1.6(D1)
$1N16587: BUZZER2.2 Q9.3(C)
$1N16655: Q9.1(B) R14.2
$1N25910: LED14.2(A) R90.1
$1N25915: LED15.2(A) R47.1
$1N29216: H14.7 R48.2
$1N29218: H14.9 R49.2
$1N41074: LED16.2(+) R93.2
$1N52937: H15.3 H15.4 R96.2
$1N74099: BUZZER2.1 R102.2
$1N77605: C78.2 D11.2(K) L13.1 U55.8(SW)
$1N77829: C82.1 U55.6(SS)
$1N78061: R103.2 U55.4(RT/SYNC)
$1N78386: C78.1 U55.1(BOOT)
$1N78931: C85.2 D12.2(K) L12.1 U56.8(SW)
$1N78939: C85.1 U56.1(BOOT)
$1N78949: R106.2 U56.4(RT/SYNC)
$1N78966: C89.1 U56.6(SS)

Not connected (* = marked no-connect by the designer): CN9 5 6; CN10 5 6; FPC1 5; U1 5(P02_4) 6(P02_5) 7(P02_6) 8(P02_7) 9(P02_8) 21(P00_12) 26(AN47) 27(AN46) 28(AN45) 29(AN44) 30(AN39) 31(AN38) 32(AN37) 33(AN36) 34(AN35) 45(AN13) 46(AN12) 47(AN11) 48(AN10) 49(AN8) 50(AN7) 51(AN6) 52(AN5) 54(AN3) 55(AN2) 56(AN1) 57(AN0) 60(P33_4) 61(P33_5) 65(P33_9) 67(P33_11) 72(P32_4) 73(P23_1) 74(P22_0) 75(P22_1) 84(P21_2) 85(P21_3) 86(P21_4) 87(P21_5) 88(P21_6/TDI) 96(ESR1_N) 98(ESR0_N) 100(P20_6) 101(P20_7) 107(P20_13) 134(P11_6) 140(P10_1) 142(P10_3); U3 4(NC); U4 4(NC); U54 4(NC)

## Notes on the sheet
- TC264最小系统
- 负压电调接口
- 各种接口
- 正交编码器
- 旋转编码器接口（EC11）
- 屏幕接口
- 舵机接口
- 指示灯
- 接蓝牙串口
- 电机输出
- 陀螺仪接口
- 电调接口隔离&电平转换
- 蜂鸣器
- 总钻风接口
- 旋转编码器接口（EC11）
- 设计失误，这个接口没有实际用途
- 舵机降压
- 可替换为RT9013
- 因为总钻风对电源要求较高
  推荐使用推荐lp5907qmfx
- 12V-5V
